# EAGLE design slice2 (EAGLE 6.4)
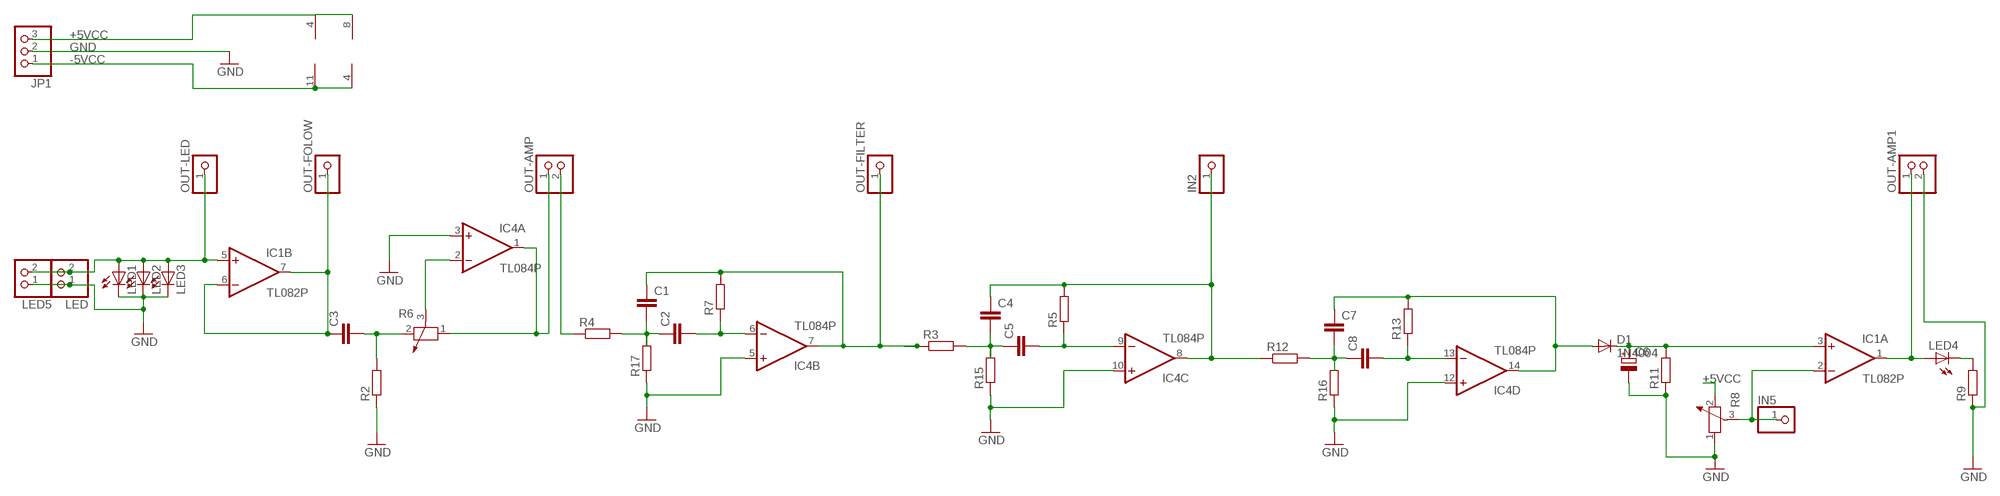
[diagram p0: schematic, sheet 1]

## Parts
C1  C-EU050-024X044  [C050-024X044]
C2  C-EU050-024X044  [C050-024X044]
C3  C-EU050-024X044  [C050-024X044]
C4  C-EU050-024X044  [C050-024X044]
C5  C-EU050-024X044  [C050-024X044]
C6  CPOL-EUE3.5-8  [E3,5-8]
C7  C-EU050-024X044  [C050-024X044]
C8  C-EU050-024X044  [C050-024X044]
D1  1N4004  [DO41-10]
IC1  TL082P  [DIL08]
IC4  TL084P  [DIL14]
IN2  PINHD-1X1  [1X01]
IN5  PINHD-1X1  [1X01]
JP1  PINHD-1X3  [1X03]
LED  PINHD-1X2  [1X02]
LED1  LED5MM  [LED5MM]
LED2  LED5MM  [LED5MM]
LED3  LED5MM  [LED5MM]
LED4  LED5MM  [LED5MM]
LED5  PINHD-1X2  [1X02]
OUT-AMP  PINHD-1X2  [1X02]
OUT-AMP1  PINHD-1X2  [1X02]
OUT-FILTER  PINHD-1X1  [1X01]
OUT-FOLOW  PINHD-1X1  [1X01]
OUT-LED  PINHD-1X1  [1X01]
R2  R-EU_0204/7  [0204/7]
R3  R-EU_0204/7  [0204/7]
R4  R-EU_0204/7  [0204/7]
R5  R-EU_0204/7  [0204/7]
R6  POTENTIOMETER_PT-10  [PT-10]
R7  R-EU_0204/7  [0204/7]
R8  POTENTIOMETER_PT-10  [PT-10]
R9  R-EU_0204/7  [0204/7]
R11  R-EU_0204/7  [0204/7]
R12  R-EU_0204/7  [0204/7]
R13  R-EU_0204/7  [0204/7]
R15  R-EU_0204/7  [0204/7]
R16  R-EU_0204/7  [0204/7]
R17  R-EU_0204/7  [0204/7]

## Nets
+5VCC: IC1.8(P:V+) IC4.4(P:V+) JP1.3 R8.2
-5VCC: IC1.4(P:V-) IC4.11(P:V-) JP1.1
GND: C6.- IC4.3(A:+IN) IC4.5(B:+IN) IC4.10(C:+IN) IC4.12(D:+IN) JP1.2 LED1.K(C) LED2.K(C) LED3.K(C) LED5.1 LED.1 OUT-AMP1.2 R2.1 R8.1 R9.1 R11.1 R15.1 R16.1 R17.1
N$1: OUT-AMP.2 R4.1
N$2: C3.2 R2.2 R6.2
N$3: C6.+ D1.C IC1.3(A:+IN) R11.2
N$4: IC1.1(A:OUT) LED4.A OUT-AMP1.1
N$5: C7.2 C8.1 R12.2 R16.2
N$6: C7.1 D1.A IC4.14(D:OUT) R13.2
N$7: C8.2 IC4.13(D:-IN) R13.1
N$9: C4.1 IC4.8(C:OUT) IN2.1 R5.2 R12.1
N$18: C4.2 C5.1 R3.2 R15.2
N$26: C5.2 IC4.9(C:-IN) R5.1
N$35: C1.1 IC4.7(B:OUT) OUT-FILTER.1 R3.1 R7.2
N$51: IC1.5(B:+IN) LED1.A LED2.A LED3.A LED5.2 LED.2 OUT-LED.1
N$172: C3.1 IC1.6(B:-IN) IC1.7(B:OUT) OUT-FOLOW.1
N$173: IC4.2(A:-IN) R6.3
N$174: IC4.1(A:OUT) OUT-AMP.1 R6.1
N$175: C1.2 C2.1 R4.2 R17.2
N$177: C2.2 IC4.6(B:-IN) R7.1
N$179: IC1.2(A:-IN) IN5.1 R8.3
N$181: LED4.K(C) R9.2

## Library data of the parts
C1-C5 C7 C8 = rcl:C-EU: CAPACITOR, European symbol
C6 = rcl:CPOL-EU: POLARIZED CAPACITOR, European symbol
D1 = diode:1N4004: DIODE general purpose rectifier, 1 A
IC1 = linear:TL082: OP AMP
IC4 = linear:TL084: OP AMP
IN2 IN5 OUT-FILTER OUT-FOLOW OUT-LED = pinhead:PINHD-1X1: PIN HEADER
JP1 = pinhead:PINHD-1X3: PIN HEADER
LED LED5 OUT-AMP OUT-AMP1 = pinhead:PINHD-1X2: PIN HEADER
LED1-LED4 = led:LED: LED OSRAM: - CHIPLED LG R971, LG N971, LY N971, LG Q971, LY Q971, LO R971, LY R971 LH N974, LH R974 LS Q976, LO Q976, LY Q976 LO Q996 - Hyper CHIPLED LW Q18S LB Q993, LB Q99A, LB R99A - SideLED LS A670, LO A670, LY A670, LG A670, LP A670 LB A673, LV A673, LT A673, LW A673 LH A674 LY A675 LS A676, LA A676, LO A676, LY A676, LW A676 LS A679, LY A679, LG A679 - Hyper Micro SIDELED® LS Y876, LA Y876, LO Y876, LY Y876 LT Y87S - SmartLED LW L88C, LW L88S LB L89C, LB L89S, LG L890 LS L89K, LO L89K, LY L89K LS L896, LA L896, LO L896, LY L896 - TOPLED LS T670, LO T670, LY T670, LG T670, LP T670 LSG T670, LSP T670, LSY T670, LOP T670, LYG T670 LG T671, LOG T671, LSG T671 LB T673, LV T673, LT T673, LW T673 LH T674 LS T676, LA T676, LO T676, LY T676, LB T676, LH T676, LSB T676, LW T676 LB T67C, LV T67C, LT T67C, LS T67K, LO T67K, LY T67K, LW E67C LS E67B, LA E67B, LO E67B, LY E67B, LB E67C, LV E67C, LT E67C LW T67C LS T679, LY T679, LG T679 LS T770, LO T770, LY T770, LG T770, LP T770 LB T773, LV T773, LT T773, LW T773 LH T774 LS E675, LA E675, LY E675, LS T675 LS T776, LA T776, LO T776, LY T776, LB T776 LHGB T686 LT T68C, LB T68C - Hyper Mini TOPLED® LB M676 - Mini TOPLED Santana® LG M470 LS M47K, LO M47K, LY M47K Source: http://www.osram.convergy.de LUXEON: - LUMILED® LXK2-PW12-R00, LXK2-PW12-S00, LXK2-PW14-U00, LXK2-PW14-V00 LXK2-PM12-R00, LXK2-PM12-S00, LXK2-PM14-U00 LXK2-PE12-Q00, LXK2-PE12-R00, LXK2-PE12-S00, LXK2-PE14-T00, LXK2-PE14-U00 LXK2-PB12-K00, LXK2-PB12-L00, LXK2-PB12-M00, LXK2-PB14-N00, LXK2-PB14-P00, LXK2-PB14-Q00 LXK2-PR12-L00, LXK2-PR12-M00, LXK2-PR14-Q00, LXK2-PR14-R00 LXK2-PD12-Q00, LXK2-PD12-R00, LXK2-PD12-S00 LXK2-PH12-R00, LXK2-PH12-S00 LXK2-PL12-P00, LXK2-PL12-Q00, LXK2-PL12-R00 Source: www.luxeon.com KINGBRIGHT: KA-3528ASYC Source: www.kingbright.com
R2-R5 R7 R9 R11-R13 R15-R17 = rcl:R-EU_: RESISTOR, European symbol
R6 R8 = rcl:POTENTIOMETER_: Potentiometer

## Board
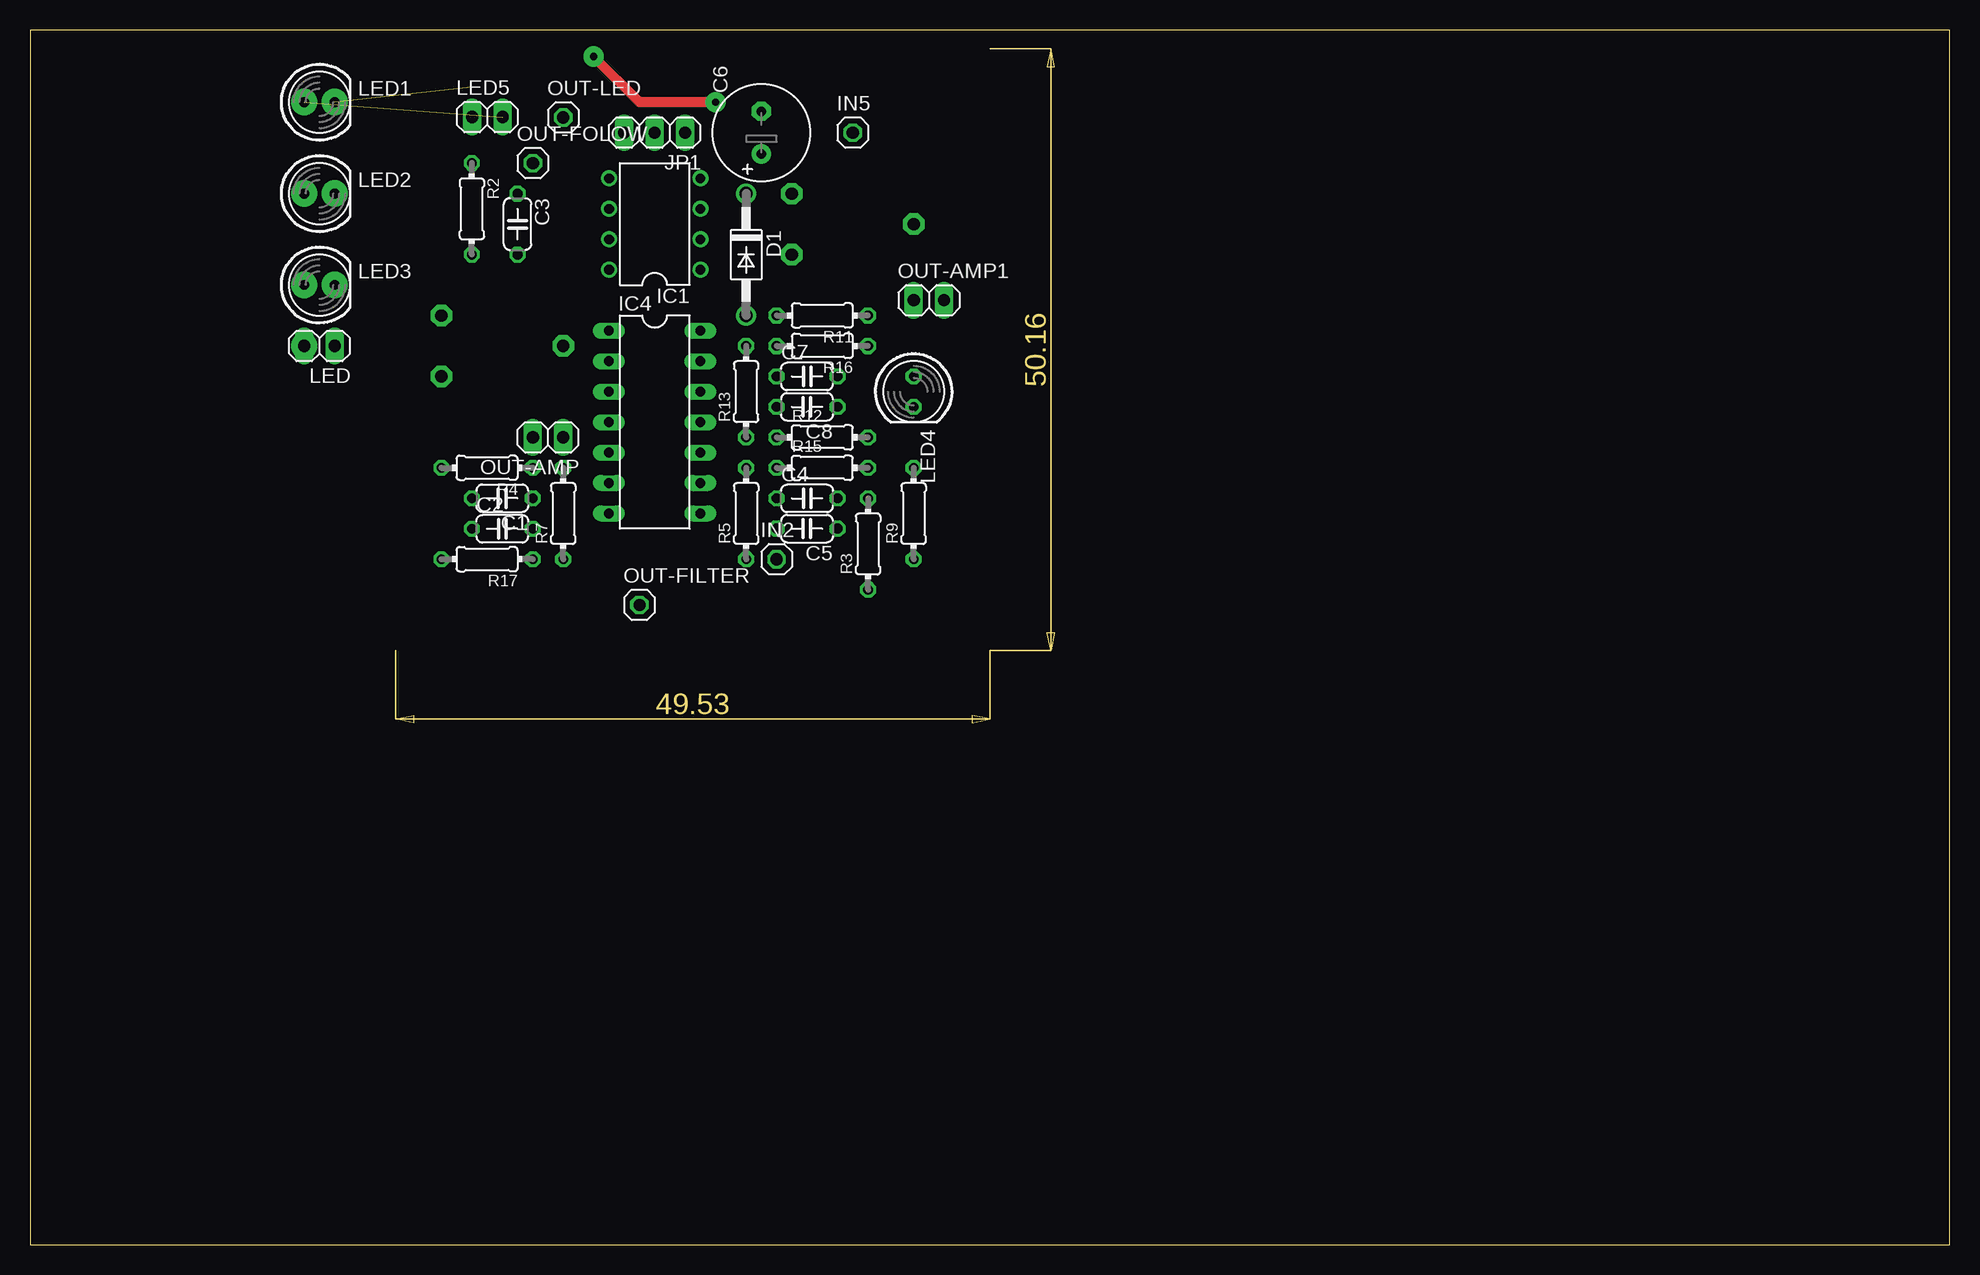
[diagram p1: board, top side]
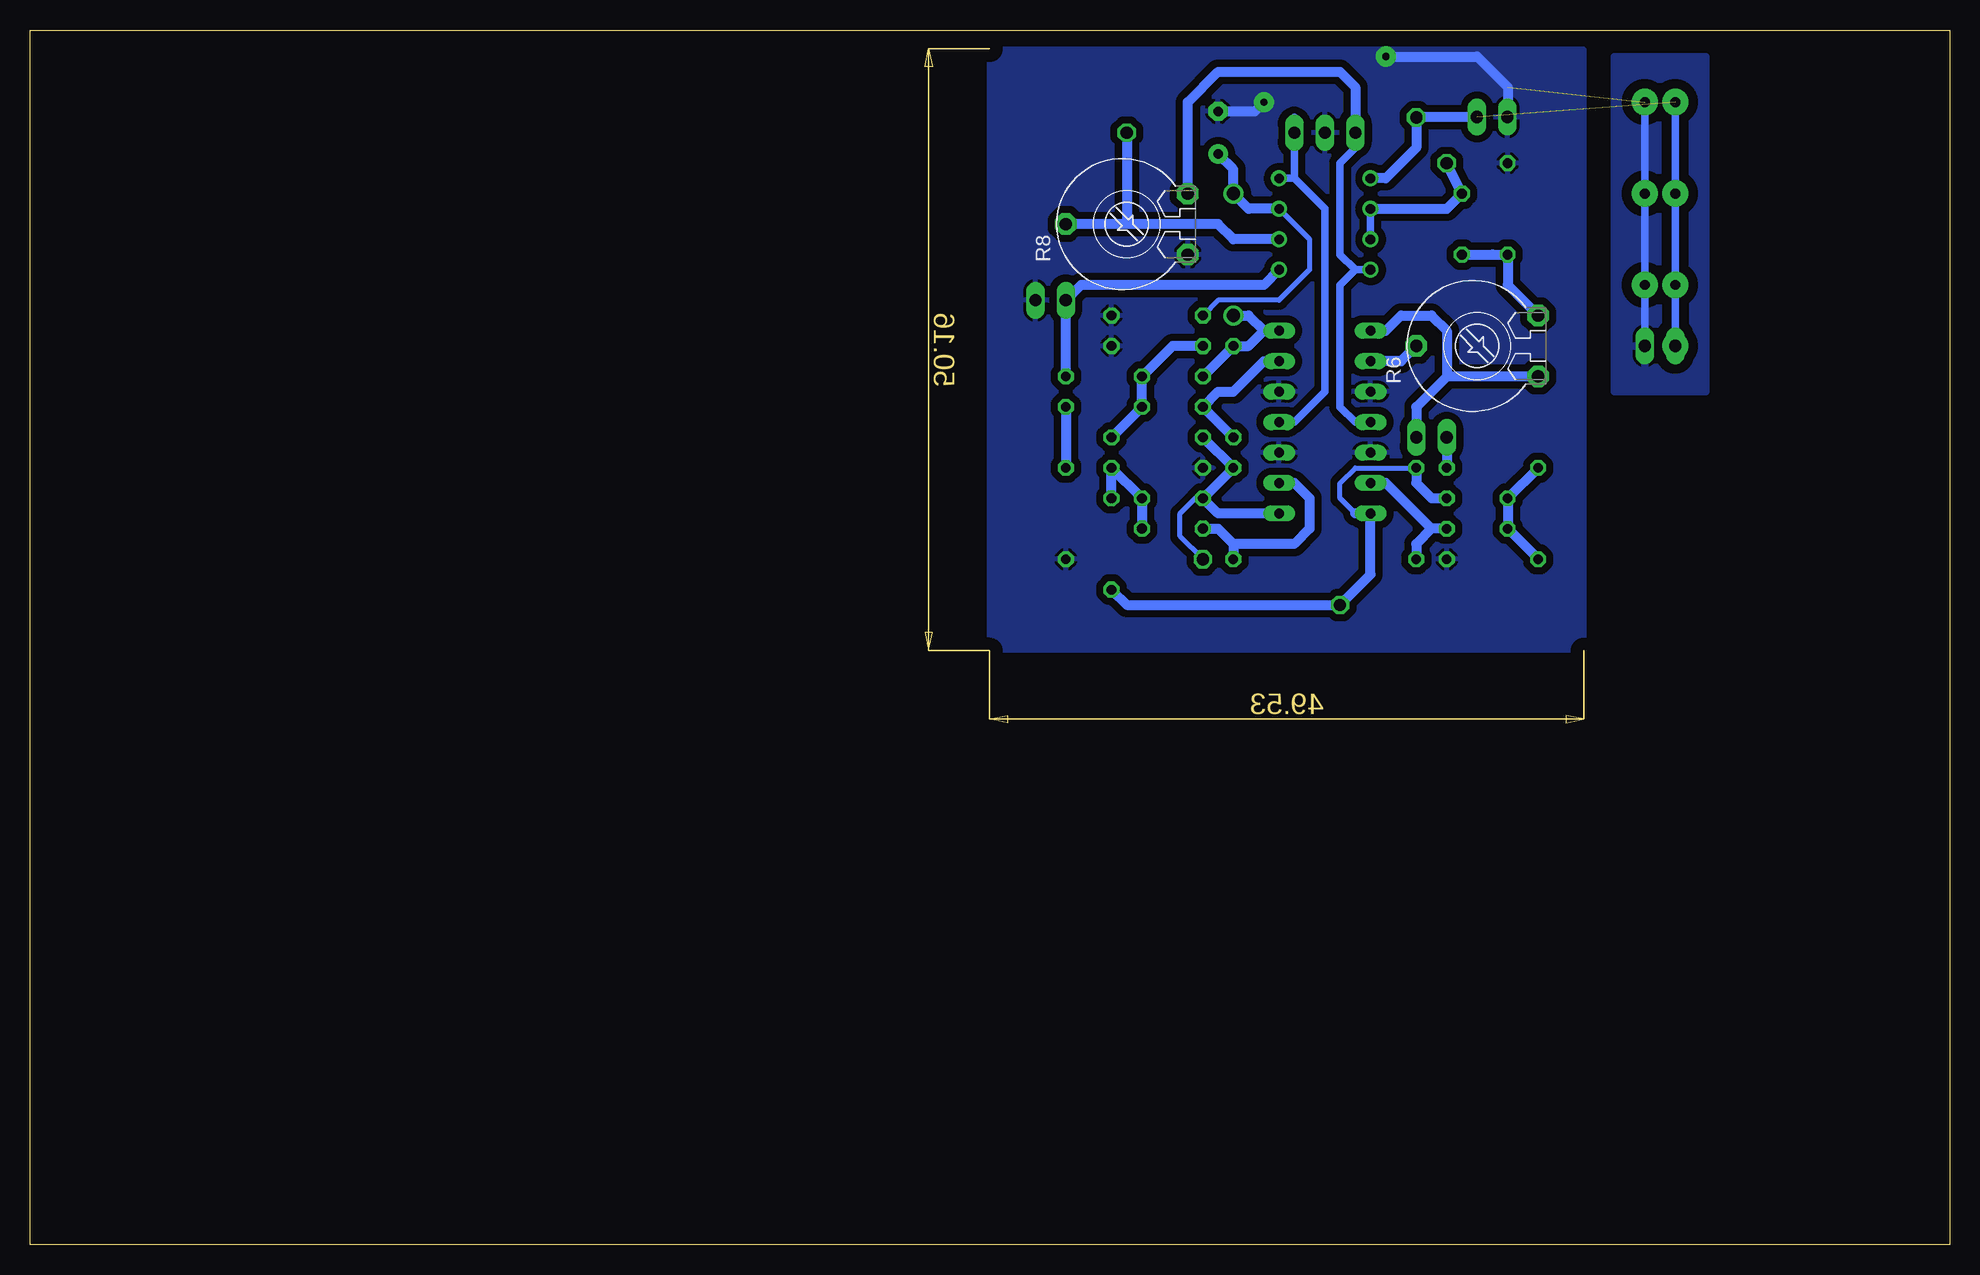
[diagram p2: board, bottom side, seen from below]

Size 160 x 101.27 mm. Coordinates in mm from the lower left corner, seen from the top.
Outline: 0,0 160,0 160,101.27 0,101.27 0,0
Copper layers (1*16): Top 0.035mm / dielectric 1.5mm / Bottom 0.035mm
Design rules "default": minimum track width 10mil, minimum drill 24mil, track to track 8mil, track to pad 8mil, pad to pad 8mil, via to via 8mil, smd to smd 8mil, copper to edge 40mil, drill to drill 8mil, minimum pad ring 10mil, minimum via ring 8mil, stop-mask expansion 4mil, vias tented up to drill 0mil, thermal gap 10mil

### Footprints (pad centres in the part's own frame; a part is rotated, then mirrored left to right if it is on the bottom)
C050-024X044 = drill 0.813 octagon: 1 -2.54,0; 2 2.54,0
E3,5-8 = drill 0.813 pad 1.6: + -1.778,0 | drill 0.813 pad 1.6 octagon: - 1.778,0
DO41-10 = drill 1.118: A 5.08,0; C -5.08,0
DIL08 = drill 0.813 pad 1.27: 1 -3.81,-3.81; 2 -1.27,-3.81; 3 1.27,-3.81; 4 3.81,-3.81; 5 3.81,3.81; 6 1.27,3.81; 7 -1.27,3.81; 8 -3.81,3.81
DIL14 = drill 0.813 long: 1 -7.62,-3.81; 2 -5.08,-3.81; 3 -2.54,-3.81; 4 0,-3.81; 5 2.54,-3.81; 6 5.08,-3.81; 7 7.62,-3.81; 8 7.62,3.81; 9 5.08,3.81; 10 2.54,3.81; 11 0,3.81; 12 -2.54,3.81; 13 -5.08,3.81; 14 -7.62,3.81
1X01 = drill 1.016 octagon: 1 0,0
1X03 = drill 1.016 long: 1 -2.54,0; 2 0,0; 3 2.54,0
1X02 = drill 1.016 long: 1 -1.27,0; 2 1.27,0
LED5MM = drill 0.813 octagon: A -1.27,0; K 1.27,0
0204/7 = drill 0.813 octagon: 1 -3.81,0; 2 3.81,0
PT-10 = drill 1.016 pad 1.778 octagon: 1 -2.54,-5.08; 2 2.54,-5.08; 3 0,5.08

### Placement (x,y rotation side)
C1  39.37,62.23 180 top
C2  39.37,59.69 0 top
C3  40.64,85.09 270 top
C4  64.77,62.22 0 top
C5  64.77,59.7 180 top
C6  60.96,92.71 90 top
C7  64.77,72.39 0 top
C8  64.77,69.85 180 top
D1  59.69,82.55 270 top
IC1  52.07,85.09 90 top
IC4  52.07,68.58 270 top
IN2  62.23,57.15 0 top
IN5  68.58,92.71 0 top
JP1  52.07,92.71 180 top
LED  24.13,74.93 180 top
LED1  24.13,95.25 0 top
LED2  24.13,87.63 0 top
LED3  24.13,80.01 0 top
LED4  73.66,71.12 270 top
LED5  38.12,94.02 0 top
OUT-AMP  43.18,67.31 180 top
OUT-AMP1  74.93,78.74 0 top
OUT-FILTER  50.8,53.34 0 top
OUT-FOLOW  41.91,90.17 0 top
OUT-LED  44.45,93.98 0 top
R2  36.83,86.36 270 top
R3  69.86,58.42 90 top
R4  38.1,64.77 180 top
R5  59.7,60.96 90 top
R6  39.37,74.93 90 bottom
R7  44.45,60.96 90 top
R8  68.58,85.09 90 bottom
R9  73.66,60.96 90 top
R11  66.04,77.47 180 top
R12  66.04,67.31 0 top
R13  59.69,71.12 90 top
R15  66.04,64.77 0 top
R16  66.04,74.93 180 top
R17  38.1,57.15 180 top

### Tracks (layer width: path | path; a pad name or v marks a point on that pad's centre or on a via)
+5VCC
  Bottom 0.61: JP1.3 49.53,91.44 50.8,90.17 50.8,82.55 49.53,81.28 | IC1.8 49.53,81.28 | 49.53,81.28 50.8,80.01 50.8,69.85 49.53,68.58 IC4.4
  Bottom 0.813: R8.2 63.5,95.25 60.96,97.79 50.8,97.79 49.53,96.52 JP1.3
-5VCC
  Bottom 0.61: IC1.4 54.61,88.9 | 54.61,88.9 52.07,86.36 52.07,71.12 54.61,68.58 IC4.11 | 54.61,88.9 54.61,93.98 JP1.1
GND  (via drill 0.6 pad 1.68)  (1 unrouted)
  Top 0.813: v57.15,95.25 50.8,95.25 v46.99,99.06
  Bottom 0.61: LED1.K LED2.K LED3.K LED.1
  Bottom 0.813: C6.- 57.91,94.49 v57.15,95.25 | v46.99,99.06 39.37,99.06 36.83,96.52 36.83,94.03 LED5.1
  pour Bottom (isolate 0.61): 33.02,97.79 33.02,52.07 80.01,52.07 80.01,97.79
  pour Bottom (isolate 0.813): 20.32,99.06 20.32,71.12 27.94,71.12 27.94,99.06
  pour Bottom (isolate 0.61): 30.48,99.69 30.48,49.53 80.01,49.53 80.01,99.69
N$1
  Bottom 0.813: OUT-AMP.2 R4.1
N$2
  Bottom 0.813: C3.2 38.1,82.55 R2.2 36.83,80.01 R6.2
N$3
  Bottom 0.406: 58.42,86.36 IC1.3 53.34,83.82 53.34,81.28 55.88,78.74 60.96,78.74 R11.2
  Bottom 0.813: IC1.3 58.42,86.36 D1.C 59.69,89.66 C6.+
N$4
  Bottom 0.813: IC1.1 57.15,80.01 72.39,80.01 OUT-AMP1.1 LED4.A
N$5
  Bottom 0.813: R12.2 C8.1 C7.2 64.77,74.93 R16.2
N$6
  Bottom 0.813: C7.1 R13.2 58.42,74.93 57.15,76.2 | 57.15,76.2 IC4.14 | D1.A 58.42,77.47 57.15,76.2
N$7
  Bottom 0.813: R13.1 C8.2 60.96,71.12 59.69,71.12 57.15,73.66 IC4.13
N$9
  Bottom 0.406: IN2.1 64.14,59.05 64.14,60.96 62.87,62.23 C4.1
  Bottom 0.813: R12.1 R5.2 59.7,64.75 C4.1 60.97,60.96 IC4.8
N$18
  Bottom 0.813: C5.1 C4.2 67.31,62.23 R15.2 R3.2
N$26
  Bottom 0.813: C5.2 60.97,59.7 59.69,58.42 | 59.69,58.42 59.69,57.16 R5.1 | IC4.9 54.61,63.5 53.34,62.23 53.34,59.69 54.61,58.42 59.69,58.42
N$35
  Bottom 0.406: 49.53,60.96 50.8,62.23 50.8,63.5 49.53,64.77 R7.2
  Bottom 0.813: R7.2 44.45,63.5 43.18,62.23 C1.1 | 49.53,60.96 IC4.7 48.26,55.88 OUT-FILTER.1 68.58,53.34 69.84,54.6 R3.1
N$37  (via drill 0.6 pad 2.18)
  other vias: 25.41,95.27
N$38  (via drill 0.6 pad 2.18)
  other vias: 22.87,95.27
N$39  (via drill 0.6 pad 2.18)
  other vias: 22.87,87.65
N$40  (via drill 0.6 pad 2.18)
  other vias: 25.41,87.65
N$41  (via drill 0.6 pad 2.18)
  other vias: 25.41,80.03
N$42  (via drill 0.6 pad 2.18)
  other vias: 22.87,80.03
N$43  (via drill 0.6 pad 2.18)
  other vias: 22.87,74.94
N$51  (1 unrouted)
  Bottom 0.61: LED1.A LED2.A LED3.A LED.2
  Bottom 0.813: LED5.2 44.41,94.02 OUT-LED.1 44.45,91.44 46.99,88.9 IC1.5
N$172
  Bottom 0.61: IC1.7 IC1.6
  Bottom 0.813: IC1.6 41.91,86.36 C3.1 OUT-FOLOW.1
N$173
  Bottom 0.813: R6.3 45.72,73.66 IC4.2
N$174
  Bottom 0.813: R6.1 41.91,72.39 | 41.91,72.39 44.45,69.85 OUT-AMP.1 | IC4.1 46.99,76.2 45.72,77.47 43.18,77.47 41.91,76.2 41.91,72.39
N$175
  Bottom 0.813: R4.2 C1.2 C2.1 R17.2
N$177
  Bottom 0.813: C2.2 43.18,59.69 | 43.18,59.69 44.45,58.42 R7.1 | 43.18,59.69 46.99,63.5 IC4.6
N$179
  Bottom 0.813: IC1.2 59.69,83.82 60.96,85.09 68.58,85.09 | 68.58,85.09 R8.3 | IN5.1 68.58,85.09
N$181
  Bottom 0.813: LED4.K R9.2